# EAGLE schematic pinout-eagle-schematic (EAGLE 7.6.0)
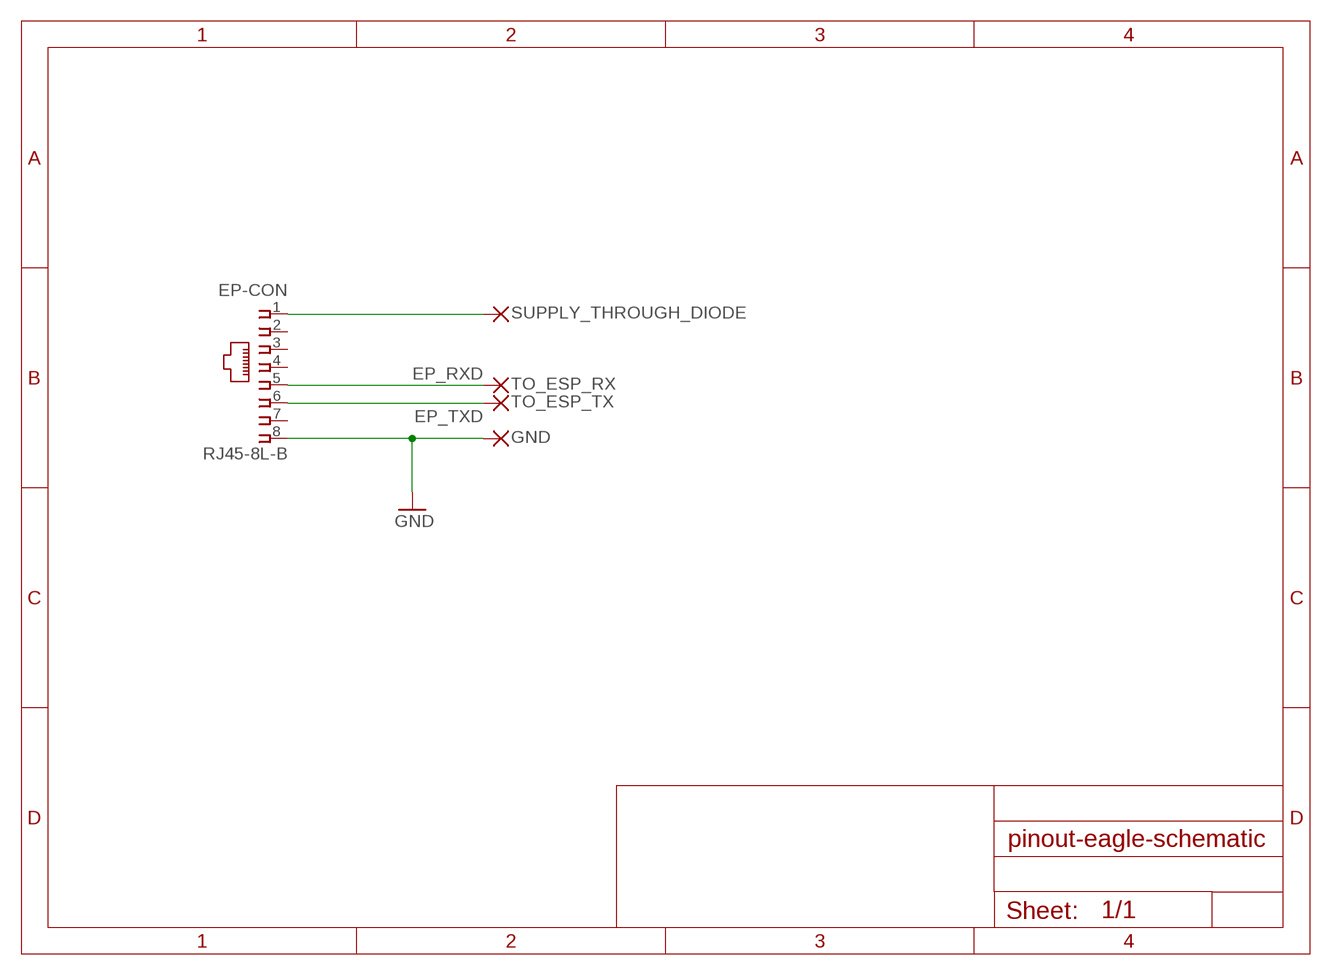
[diagram p0: schematic, sheet 1]

## Parts
EP-CON  RJ45-8L-B  [RJ45-NO-SHIELD]
GND  SMD2  [SMD1,27-2,54]
SUPPLY_THROUGH_DIODE  SMD2  [SMD1,27-2,54]
TO_ESP_RX  SMD2  [SMD1,27-2,54]
TO_ESP_TX  SMD2  [SMD1,27-2,54]

## Nets
EP_RXD: EP-CON.5 TO_ESP_RX.1(P)
EP_TXD: EP-CON.6 TO_ESP_TX.1(P)
GND: EP-CON.8 GND.1(P)
N$3: EP-CON.1 SUPPLY_THROUGH_DIODE.1(P)
Unconnected: EP-CON.2 EP-CON.3 EP-CON.4 EP-CON.7

## Library data of the parts
EP-CON = con-tycoelectronics:RJ45: CORCOM Modular RJ Jacks No Shield Source: www.tycoelectronics.com .. ENG_DS_1654001_1099_RJ_L_0507.pdf; MF: TYCO ELECTRONICS; MPN: RJ45-8L-B; OC_FARNELL: 1279843; OC_NEWARK: 52K4445
GND SUPPLY_THROUGH_DIODE TO_ESP_RX TO_ESP_TX = wirepad:SMD2: SMD PAD